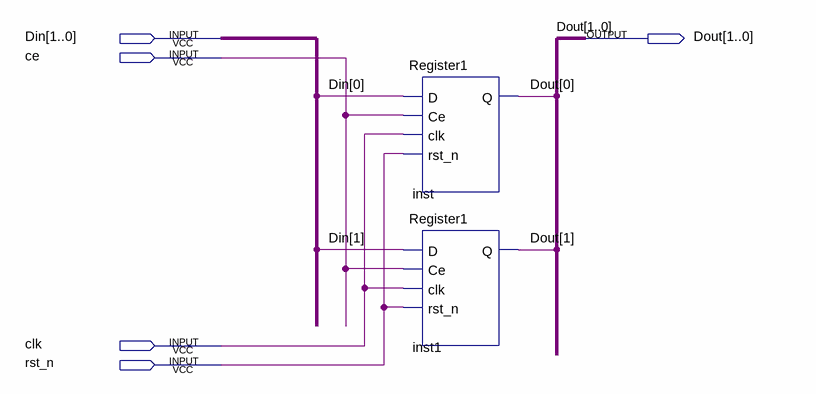
[diagram p0: schematic sheet]
// Quartus schematic Register2.bdf as structural Verilog: 2 symbols, 5 pins
module Register2 (
  input  [1:0] Din,
  input  ce,
  input  clk,
  input  rst_n,
  output [1:0] Dout
);

  Register1 inst (.D(Din[0]), .Ce(ce), .clk(clk), .rst_n(rst_n), .Q(Dout[0]));
  Register1 inst1 (.D(Din[1]), .Ce(ce), .clk(clk), .rst_n(rst_n), .Q(Dout[1]));
endmodule
